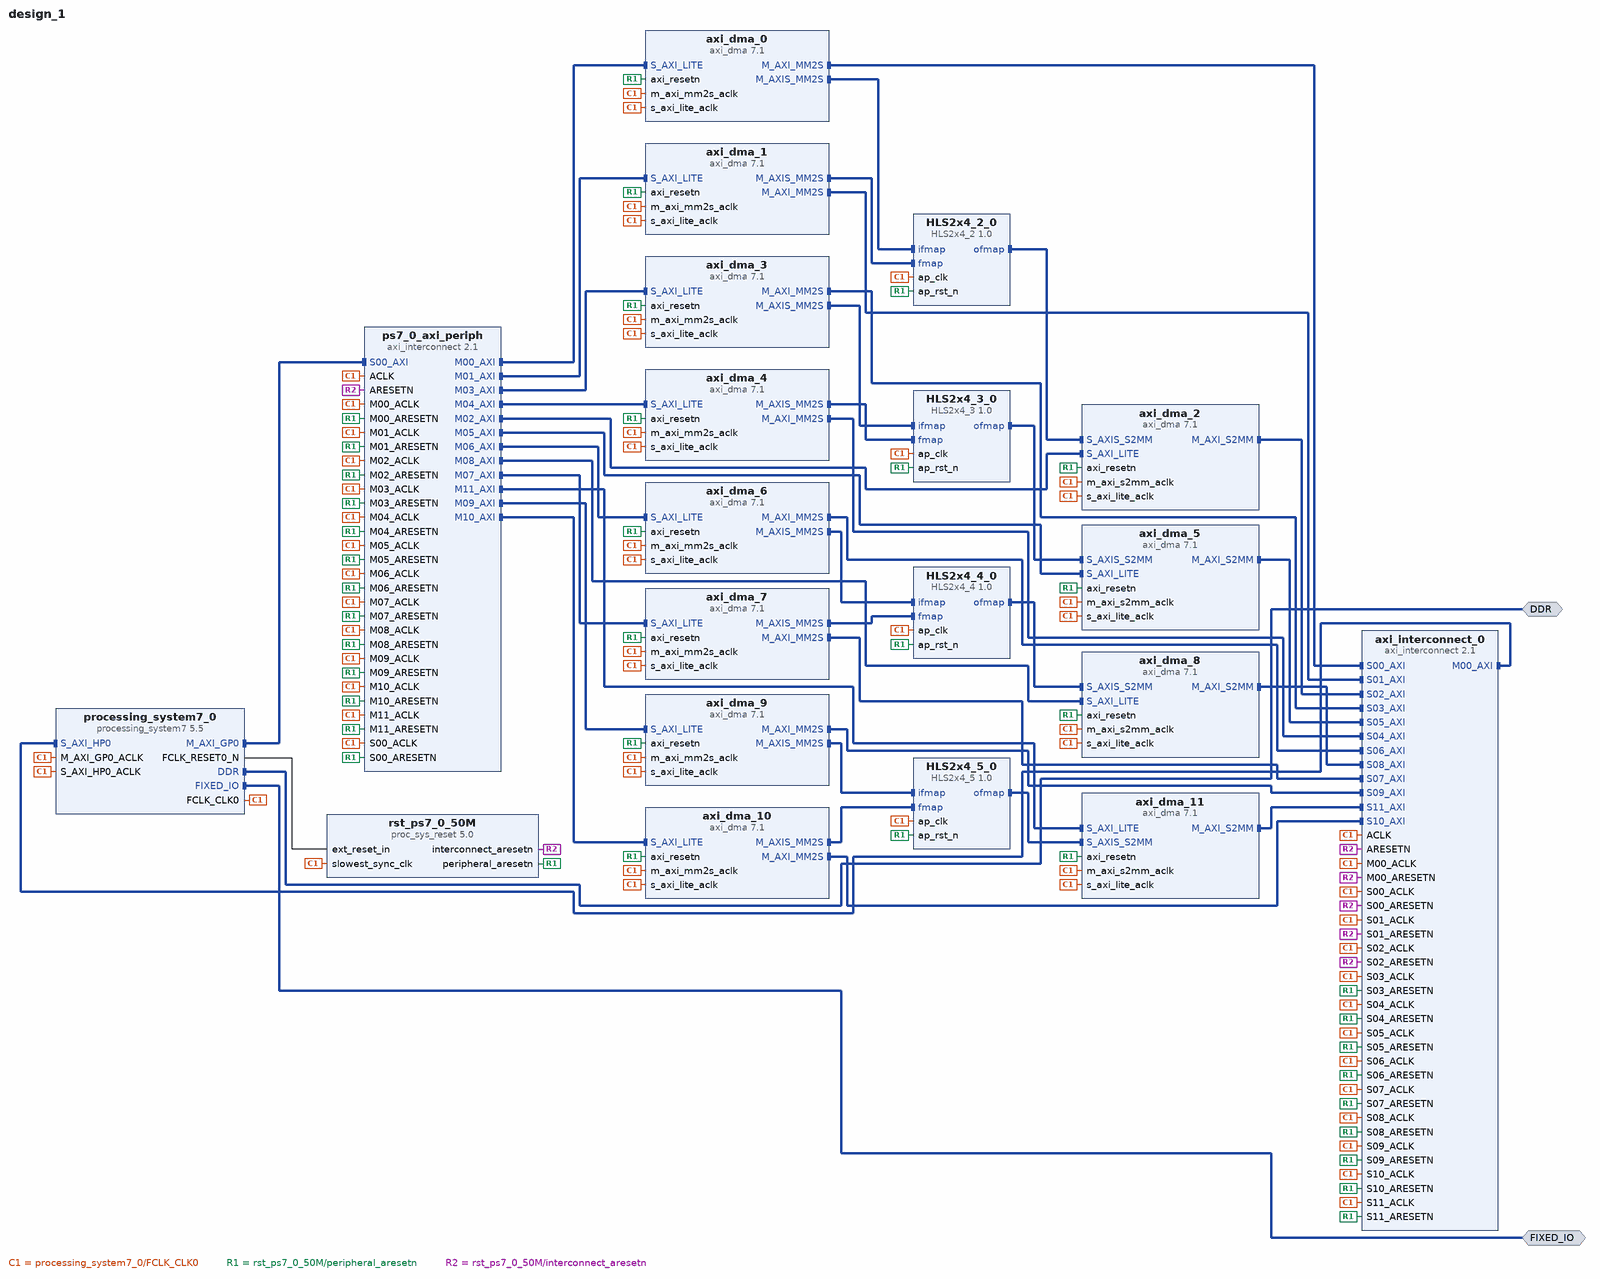
[diagram p0: block diagram of the top level]
# Vivado block design design_1, xc7z020clg400-1, Vivado 2017.4
create_bd_design design_1

create_bd_intf_port -mode Master -vlnv xilinx.com:interface:ddrx_rtl:1.0 DDR
create_bd_intf_port -mode Master -vlnv xilinx.com:display_processing_system7:fixedio_rtl:1.0 FIXED_IO

create_bd_cell -type ip -vlnv xilinx.com:user:HLS2x4_2:1.0 HLS2x4_2_0
create_bd_cell -type ip -vlnv xilinx.com:ip:processing_system7:5.5 processing_system7_0
set_property -dict [list \
  CONFIG.PCW_UIPARAM_DDR_FREQ_MHZ 533.333333 \
  CONFIG.PCW_APU_PERIPHERAL_FREQMHZ 667 \
  CONFIG.PCW_UART_PERIPHERAL_FREQMHZ 100 \
  CONFIG.PCW_USE_S_AXI_HP0 1 \
  CONFIG.PCW_PRESET_BANK1_VOLTAGE {LVCMOS 1.8V} \
  CONFIG.PCW_UIPARAM_DDR_MEMORY_TYPE {DDR 3 (Low Voltage)} \
  CONFIG.PCW_UIPARAM_DDR_PARTNO {MT41K256M16 RE-125} \
  CONFIG.PCW_QSPI_PERIPHERAL_ENABLE 0 \
  CONFIG.PCW_ENET0_PERIPHERAL_ENABLE 0 \
  CONFIG.PCW_SD0_PERIPHERAL_ENABLE 0 \
  CONFIG.PCW_UART1_PERIPHERAL_ENABLE 1 \
  CONFIG.PCW_UART1_UART1_IO {MIO 48 .. 49} \
  CONFIG.PCW_USB0_PERIPHERAL_ENABLE 0 \
  CONFIG.PCW_GPIO_MIO_GPIO_ENABLE 0 \
] [get_bd_cells processing_system7_0]
# 145 more settings of processing_system7_0 are not shown: defaults, MIO pin electricals, DDR timing, and values the tool derives
create_bd_cell -type ip -vlnv xilinx.com:ip:axi_dma:7.1 axi_dma_0
set_property -dict [list \
  CONFIG.c_include_sg 0 \
  CONFIG.c_sg_length_width 23 \
  CONFIG.c_mm2s_burst_size 64 \
  CONFIG.c_include_s2mm 0 \
] [get_bd_cells axi_dma_0]
create_bd_cell -type ip -vlnv xilinx.com:ip:axi_interconnect:2.1 ps7_0_axi_periph
set_property -dict {CONFIG.NUM_MI 12} [get_bd_cells ps7_0_axi_periph]
create_bd_cell -type ip -vlnv xilinx.com:ip:proc_sys_reset:5.0 rst_ps7_0_50M
create_bd_cell -type ip -vlnv xilinx.com:ip:axi_dma:7.1 axi_dma_1
set_property -dict [list \
  CONFIG.c_include_sg 0 \
  CONFIG.c_sg_length_width 23 \
  CONFIG.c_mm2s_burst_size 64 \
  CONFIG.c_include_s2mm 0 \
] [get_bd_cells axi_dma_1]
create_bd_cell -type ip -vlnv xilinx.com:ip:axi_dma:7.1 axi_dma_2
set_property -dict [list \
  CONFIG.c_include_sg 0 \
  CONFIG.c_sg_length_width 23 \
  CONFIG.c_include_mm2s 0 \
  CONFIG.c_s2mm_burst_size 64 \
] [get_bd_cells axi_dma_2]
create_bd_cell -type ip -vlnv xilinx.com:ip:axi_interconnect:2.1 axi_interconnect_0
set_property -dict {CONFIG.NUM_SI 12 CONFIG.NUM_MI 1} [get_bd_cells axi_interconnect_0]
create_bd_cell -type ip -vlnv xilinx.com:ip:axi_dma:7.1 axi_dma_3
set_property -dict [list \
  CONFIG.c_include_sg 0 \
  CONFIG.c_sg_length_width 23 \
  CONFIG.c_mm2s_burst_size 64 \
  CONFIG.c_include_s2mm 0 \
] [get_bd_cells axi_dma_3]
create_bd_cell -type ip -vlnv xilinx.com:ip:axi_dma:7.1 axi_dma_4
set_property -dict [list \
  CONFIG.c_include_sg 0 \
  CONFIG.c_sg_length_width 23 \
  CONFIG.c_mm2s_burst_size 64 \
  CONFIG.c_include_s2mm 0 \
] [get_bd_cells axi_dma_4]
create_bd_cell -type ip -vlnv xilinx.com:ip:axi_dma:7.1 axi_dma_5
set_property -dict [list \
  CONFIG.c_include_sg 0 \
  CONFIG.c_sg_length_width 23 \
  CONFIG.c_include_mm2s 0 \
  CONFIG.c_s2mm_burst_size 64 \
] [get_bd_cells axi_dma_5]
create_bd_cell -type ip -vlnv xilinx.com:user:HLS2x4_3:1.0 HLS2x4_3_0
create_bd_cell -type ip -vlnv xilinx.com:ip:axi_dma:7.1 axi_dma_6
set_property -dict [list \
  CONFIG.c_include_sg 0 \
  CONFIG.c_sg_length_width 23 \
  CONFIG.c_mm2s_burst_size 64 \
  CONFIG.c_include_s2mm 0 \
] [get_bd_cells axi_dma_6]
create_bd_cell -type ip -vlnv xilinx.com:ip:axi_dma:7.1 axi_dma_7
set_property -dict [list \
  CONFIG.c_include_sg 0 \
  CONFIG.c_sg_length_width 23 \
  CONFIG.c_mm2s_burst_size 64 \
  CONFIG.c_include_s2mm 0 \
] [get_bd_cells axi_dma_7]
create_bd_cell -type ip -vlnv xilinx.com:ip:axi_dma:7.1 axi_dma_8
set_property -dict [list \
  CONFIG.c_include_sg 0 \
  CONFIG.c_sg_length_width 23 \
  CONFIG.c_include_mm2s 0 \
  CONFIG.c_s2mm_burst_size 64 \
] [get_bd_cells axi_dma_8]
create_bd_cell -type ip -vlnv xilinx.com:user:HLS2x4_4:1.0 HLS2x4_4_0
create_bd_cell -type ip -vlnv xilinx.com:user:HLS2x4_5:1.0 HLS2x4_5_0
create_bd_cell -type ip -vlnv xilinx.com:ip:axi_dma:7.1 axi_dma_9
set_property -dict [list \
  CONFIG.c_include_sg 0 \
  CONFIG.c_sg_length_width 23 \
  CONFIG.c_mm2s_burst_size 64 \
  CONFIG.c_include_s2mm 0 \
] [get_bd_cells axi_dma_9]
create_bd_cell -type ip -vlnv xilinx.com:ip:axi_dma:7.1 axi_dma_10
set_property -dict [list \
  CONFIG.c_include_sg 0 \
  CONFIG.c_sg_length_width 23 \
  CONFIG.c_mm2s_burst_size 64 \
  CONFIG.c_include_s2mm 0 \
] [get_bd_cells axi_dma_10]
create_bd_cell -type ip -vlnv xilinx.com:ip:axi_dma:7.1 axi_dma_11
set_property -dict [list \
  CONFIG.c_include_sg 0 \
  CONFIG.c_sg_length_width 23 \
  CONFIG.c_include_mm2s 0 \
  CONFIG.c_s2mm_burst_size 64 \
] [get_bd_cells axi_dma_11]

# ---- connections ----

connect_bd_intf_net [get_bd_intf_pins processing_system7_0/M_AXI_GP0] [get_bd_intf_pins ps7_0_axi_periph/S00_AXI]
connect_bd_intf_net [get_bd_intf_pins ps7_0_axi_periph/M00_AXI] [get_bd_intf_pins axi_dma_0/S_AXI_LITE]
connect_bd_intf_net [get_bd_intf_pins ps7_0_axi_periph/M01_AXI] [get_bd_intf_pins axi_dma_1/S_AXI_LITE]
connect_bd_intf_net [get_bd_intf_pins HLS2x4_2_0/ofmap] [get_bd_intf_pins axi_dma_2/S_AXIS_S2MM]
connect_bd_intf_net [get_bd_intf_pins ps7_0_axi_periph/M02_AXI] [get_bd_intf_pins axi_dma_2/S_AXI_LITE]
connect_bd_intf_net [get_bd_intf_pins axi_dma_0/M_AXI_MM2S] [get_bd_intf_pins axi_interconnect_0/S00_AXI]
connect_bd_intf_net [get_bd_intf_pins axi_dma_1/M_AXI_MM2S] [get_bd_intf_pins axi_interconnect_0/S01_AXI]
connect_bd_intf_net [get_bd_intf_pins axi_dma_2/M_AXI_S2MM] [get_bd_intf_pins axi_interconnect_0/S02_AXI]
connect_bd_intf_net [get_bd_intf_pins axi_interconnect_0/M00_AXI] [get_bd_intf_pins processing_system7_0/S_AXI_HP0]
connect_bd_intf_net [get_bd_intf_pins HLS2x4_3_0/ofmap] [get_bd_intf_pins axi_dma_5/S_AXIS_S2MM]
connect_bd_intf_net [get_bd_intf_pins axi_dma_3/S_AXI_LITE] [get_bd_intf_pins ps7_0_axi_periph/M03_AXI]
connect_bd_intf_net [get_bd_intf_pins axi_dma_4/S_AXI_LITE] [get_bd_intf_pins ps7_0_axi_periph/M04_AXI]
connect_bd_intf_net [get_bd_intf_pins axi_dma_3/M_AXI_MM2S] [get_bd_intf_pins axi_interconnect_0/S03_AXI]
connect_bd_intf_net [get_bd_intf_pins axi_dma_4/M_AXI_MM2S] [get_bd_intf_pins axi_interconnect_0/S04_AXI]
connect_bd_intf_net [get_bd_intf_pins ps7_0_axi_periph/M05_AXI] [get_bd_intf_pins axi_dma_5/S_AXI_LITE]
connect_bd_intf_net [get_bd_intf_pins axi_dma_5/M_AXI_S2MM] [get_bd_intf_pins axi_interconnect_0/S05_AXI]
connect_bd_intf_net [get_bd_intf_pins HLS2x4_4_0/ofmap] [get_bd_intf_pins axi_dma_8/S_AXIS_S2MM]
connect_bd_intf_net [get_bd_intf_pins ps7_0_axi_periph/M06_AXI] [get_bd_intf_pins axi_dma_6/S_AXI_LITE]
connect_bd_intf_net [get_bd_intf_pins axi_dma_6/M_AXI_MM2S] [get_bd_intf_pins axi_interconnect_0/S06_AXI]
connect_bd_intf_net [get_bd_intf_pins ps7_0_axi_periph/M07_AXI] [get_bd_intf_pins axi_dma_7/S_AXI_LITE]
connect_bd_intf_net [get_bd_intf_pins axi_dma_7/M_AXI_MM2S] [get_bd_intf_pins axi_interconnect_0/S07_AXI]
connect_bd_intf_net [get_bd_intf_pins ps7_0_axi_periph/M08_AXI] [get_bd_intf_pins axi_dma_8/S_AXI_LITE]
connect_bd_intf_net [get_bd_intf_pins axi_dma_8/M_AXI_S2MM] [get_bd_intf_pins axi_interconnect_0/S08_AXI]
connect_bd_intf_net [get_bd_intf_pins HLS2x4_5_0/ofmap] [get_bd_intf_pins axi_dma_11/S_AXIS_S2MM]
connect_bd_intf_net [get_bd_intf_pins ps7_0_axi_periph/M09_AXI] [get_bd_intf_pins axi_dma_9/S_AXI_LITE]
connect_bd_intf_net [get_bd_intf_pins axi_dma_9/M_AXI_MM2S] [get_bd_intf_pins axi_interconnect_0/S09_AXI]
connect_bd_intf_net [get_bd_intf_pins ps7_0_axi_periph/M10_AXI] [get_bd_intf_pins axi_dma_10/S_AXI_LITE]
connect_bd_intf_net [get_bd_intf_pins axi_dma_10/M_AXI_MM2S] [get_bd_intf_pins axi_interconnect_0/S10_AXI]
connect_bd_intf_net [get_bd_intf_pins ps7_0_axi_periph/M11_AXI] [get_bd_intf_pins axi_dma_11/S_AXI_LITE]
connect_bd_intf_net [get_bd_intf_pins axi_dma_11/M_AXI_S2MM] [get_bd_intf_pins axi_interconnect_0/S11_AXI]
connect_bd_intf_net [get_bd_intf_pins axi_dma_3/M_AXIS_MM2S] [get_bd_intf_pins HLS2x4_3_0/ifmap]
connect_bd_intf_net [get_bd_intf_pins axi_dma_4/M_AXIS_MM2S] [get_bd_intf_pins HLS2x4_3_0/fmap]
connect_bd_intf_net [get_bd_intf_pins axi_dma_6/M_AXIS_MM2S] [get_bd_intf_pins HLS2x4_4_0/ifmap]
connect_bd_intf_net [get_bd_intf_pins axi_dma_7/M_AXIS_MM2S] [get_bd_intf_pins HLS2x4_4_0/fmap]
connect_bd_intf_net [get_bd_intf_pins axi_dma_1/M_AXIS_MM2S] [get_bd_intf_pins HLS2x4_2_0/fmap]
connect_bd_intf_net [get_bd_intf_pins axi_dma_0/M_AXIS_MM2S] [get_bd_intf_pins HLS2x4_2_0/ifmap]
connect_bd_intf_net [get_bd_intf_pins axi_dma_10/M_AXIS_MM2S] [get_bd_intf_pins HLS2x4_5_0/fmap]
connect_bd_intf_net [get_bd_intf_pins axi_dma_9/M_AXIS_MM2S] [get_bd_intf_pins HLS2x4_5_0/ifmap]
connect_bd_intf_net [get_bd_intf_ports DDR] [get_bd_intf_pins processing_system7_0/DDR]
connect_bd_intf_net [get_bd_intf_ports FIXED_IO] [get_bd_intf_pins processing_system7_0/FIXED_IO]
connect_bd_net [get_bd_pins processing_system7_0/FCLK_CLK0] \
  [get_bd_pins processing_system7_0/M_AXI_GP0_ACLK] [get_bd_pins rst_ps7_0_50M/slowest_sync_clk] \
  [get_bd_pins axi_dma_0/s_axi_lite_aclk] [get_bd_pins HLS2x4_2_0/ap_clk] [get_bd_pins axi_dma_0/m_axi_mm2s_aclk] \
  [get_bd_pins axi_dma_1/s_axi_lite_aclk] [get_bd_pins axi_dma_1/m_axi_mm2s_aclk] [get_bd_pins axi_dma_2/s_axi_lite_aclk] \
  [get_bd_pins axi_dma_2/m_axi_s2mm_aclk] [get_bd_pins processing_system7_0/S_AXI_HP0_ACLK] \
  [get_bd_pins axi_dma_3/m_axi_mm2s_aclk] [get_bd_pins axi_dma_3/s_axi_lite_aclk] [get_bd_pins axi_dma_4/m_axi_mm2s_aclk] \
  [get_bd_pins axi_dma_4/s_axi_lite_aclk] [get_bd_pins axi_dma_5/s_axi_lite_aclk] [get_bd_pins axi_dma_5/m_axi_s2mm_aclk] \
  [get_bd_pins HLS2x4_3_0/ap_clk] [get_bd_pins axi_dma_6/s_axi_lite_aclk] [get_bd_pins axi_dma_6/m_axi_mm2s_aclk] \
  [get_bd_pins axi_dma_7/s_axi_lite_aclk] [get_bd_pins axi_dma_7/m_axi_mm2s_aclk] [get_bd_pins axi_dma_8/s_axi_lite_aclk] \
  [get_bd_pins axi_dma_8/m_axi_s2mm_aclk] [get_bd_pins HLS2x4_4_0/ap_clk] [get_bd_pins HLS2x4_5_0/ap_clk] \
  [get_bd_pins axi_dma_9/s_axi_lite_aclk] [get_bd_pins axi_dma_9/m_axi_mm2s_aclk] [get_bd_pins axi_dma_10/s_axi_lite_aclk] \
  [get_bd_pins axi_dma_10/m_axi_mm2s_aclk] [get_bd_pins axi_dma_11/s_axi_lite_aclk] [get_bd_pins axi_dma_11/m_axi_s2mm_aclk] \
  [get_bd_pins ps7_0_axi_periph/S00_ACLK] [get_bd_pins ps7_0_axi_periph/M00_ACLK] [get_bd_pins ps7_0_axi_periph/ACLK] \
  [get_bd_pins ps7_0_axi_periph/M01_ACLK] [get_bd_pins ps7_0_axi_periph/M02_ACLK] [get_bd_pins axi_interconnect_0/ACLK] \
  [get_bd_pins axi_interconnect_0/M00_ACLK] [get_bd_pins axi_interconnect_0/S00_ACLK] \
  [get_bd_pins axi_interconnect_0/S01_ACLK] [get_bd_pins axi_interconnect_0/S02_ACLK] \
  [get_bd_pins axi_interconnect_0/S03_ACLK] [get_bd_pins ps7_0_axi_periph/M03_ACLK] [get_bd_pins axi_interconnect_0/S04_ACLK] \
  [get_bd_pins ps7_0_axi_periph/M04_ACLK] [get_bd_pins ps7_0_axi_periph/M05_ACLK] [get_bd_pins axi_interconnect_0/S05_ACLK] \
  [get_bd_pins ps7_0_axi_periph/M06_ACLK] [get_bd_pins axi_interconnect_0/S06_ACLK] [get_bd_pins ps7_0_axi_periph/M07_ACLK] \
  [get_bd_pins axi_interconnect_0/S07_ACLK] [get_bd_pins ps7_0_axi_periph/M08_ACLK] [get_bd_pins axi_interconnect_0/S08_ACLK] \
  [get_bd_pins ps7_0_axi_periph/M09_ACLK] [get_bd_pins axi_interconnect_0/S09_ACLK] [get_bd_pins ps7_0_axi_periph/M10_ACLK] \
  [get_bd_pins axi_interconnect_0/S10_ACLK] [get_bd_pins ps7_0_axi_periph/M11_ACLK] [get_bd_pins axi_interconnect_0/S11_ACLK]
connect_bd_net [get_bd_pins processing_system7_0/FCLK_RESET0_N] [get_bd_pins rst_ps7_0_50M/ext_reset_in]
connect_bd_net [get_bd_pins rst_ps7_0_50M/peripheral_aresetn] \
  [get_bd_pins axi_dma_0/axi_resetn] [get_bd_pins HLS2x4_2_0/ap_rst_n] [get_bd_pins axi_dma_1/axi_resetn] \
  [get_bd_pins axi_dma_2/axi_resetn] [get_bd_pins axi_dma_3/axi_resetn] [get_bd_pins axi_dma_4/axi_resetn] \
  [get_bd_pins axi_dma_5/axi_resetn] [get_bd_pins HLS2x4_3_0/ap_rst_n] [get_bd_pins axi_dma_6/axi_resetn] \
  [get_bd_pins axi_dma_7/axi_resetn] [get_bd_pins axi_dma_8/axi_resetn] [get_bd_pins HLS2x4_4_0/ap_rst_n] \
  [get_bd_pins HLS2x4_5_0/ap_rst_n] [get_bd_pins axi_dma_9/axi_resetn] [get_bd_pins axi_dma_10/axi_resetn] \
  [get_bd_pins axi_dma_11/axi_resetn] [get_bd_pins ps7_0_axi_periph/S00_ARESETN] [get_bd_pins ps7_0_axi_periph/M00_ARESETN] \
  [get_bd_pins ps7_0_axi_periph/M01_ARESETN] [get_bd_pins ps7_0_axi_periph/M02_ARESETN] \
  [get_bd_pins axi_interconnect_0/S03_ARESETN] [get_bd_pins ps7_0_axi_periph/M03_ARESETN] \
  [get_bd_pins axi_interconnect_0/S04_ARESETN] [get_bd_pins ps7_0_axi_periph/M04_ARESETN] \
  [get_bd_pins ps7_0_axi_periph/M05_ARESETN] [get_bd_pins axi_interconnect_0/S05_ARESETN] \
  [get_bd_pins ps7_0_axi_periph/M06_ARESETN] [get_bd_pins axi_interconnect_0/S06_ARESETN] \
  [get_bd_pins ps7_0_axi_periph/M07_ARESETN] [get_bd_pins axi_interconnect_0/S07_ARESETN] \
  [get_bd_pins ps7_0_axi_periph/M08_ARESETN] [get_bd_pins axi_interconnect_0/S08_ARESETN] \
  [get_bd_pins ps7_0_axi_periph/M09_ARESETN] [get_bd_pins axi_interconnect_0/S09_ARESETN] \
  [get_bd_pins ps7_0_axi_periph/M10_ARESETN] [get_bd_pins axi_interconnect_0/S10_ARESETN] \
  [get_bd_pins ps7_0_axi_periph/M11_ARESETN] [get_bd_pins axi_interconnect_0/S11_ARESETN]
connect_bd_net [get_bd_pins rst_ps7_0_50M/interconnect_aresetn] \
  [get_bd_pins ps7_0_axi_periph/ARESETN] [get_bd_pins axi_interconnect_0/ARESETN] \
  [get_bd_pins axi_interconnect_0/S00_ARESETN] [get_bd_pins axi_interconnect_0/M00_ARESETN] \
  [get_bd_pins axi_interconnect_0/S02_ARESETN] [get_bd_pins axi_interconnect_0/S01_ARESETN]

# ---- address map ----
assign_bd_address -offset 0x00000000 -range 1G -target_address_space [get_bd_addr_spaces axi_dma_0/Data_MM2S] [get_bd_addr_segs processing_system7_0/S_AXI_HP0/HP0_DDR_LOWOCM]
assign_bd_address -offset 0x00000000 -range 1G -target_address_space [get_bd_addr_spaces axi_dma_1/Data_MM2S] [get_bd_addr_segs processing_system7_0/S_AXI_HP0/HP0_DDR_LOWOCM]
assign_bd_address -offset 0x00000000 -range 1G -target_address_space [get_bd_addr_spaces axi_dma_2/Data_S2MM] [get_bd_addr_segs processing_system7_0/S_AXI_HP0/HP0_DDR_LOWOCM]
assign_bd_address -offset 0x00000000 -range 1G -target_address_space [get_bd_addr_spaces axi_dma_3/Data_MM2S] [get_bd_addr_segs processing_system7_0/S_AXI_HP0/HP0_DDR_LOWOCM]
assign_bd_address -offset 0x00000000 -range 1G -target_address_space [get_bd_addr_spaces axi_dma_4/Data_MM2S] [get_bd_addr_segs processing_system7_0/S_AXI_HP0/HP0_DDR_LOWOCM]
assign_bd_address -offset 0x00000000 -range 1G -target_address_space [get_bd_addr_spaces axi_dma_5/Data_S2MM] [get_bd_addr_segs processing_system7_0/S_AXI_HP0/HP0_DDR_LOWOCM]
assign_bd_address -offset 0x00000000 -range 1G -target_address_space [get_bd_addr_spaces axi_dma_6/Data_MM2S] [get_bd_addr_segs processing_system7_0/S_AXI_HP0/HP0_DDR_LOWOCM]
assign_bd_address -offset 0x00000000 -range 1G -target_address_space [get_bd_addr_spaces axi_dma_7/Data_MM2S] [get_bd_addr_segs processing_system7_0/S_AXI_HP0/HP0_DDR_LOWOCM]
assign_bd_address -offset 0x00000000 -range 1G -target_address_space [get_bd_addr_spaces axi_dma_8/Data_S2MM] [get_bd_addr_segs processing_system7_0/S_AXI_HP0/HP0_DDR_LOWOCM]
assign_bd_address -offset 0x00000000 -range 1G -target_address_space [get_bd_addr_spaces axi_dma_9/Data_MM2S] [get_bd_addr_segs processing_system7_0/S_AXI_HP0/HP0_DDR_LOWOCM]
assign_bd_address -offset 0x00000000 -range 1G -target_address_space [get_bd_addr_spaces axi_dma_10/Data_MM2S] [get_bd_addr_segs processing_system7_0/S_AXI_HP0/HP0_DDR_LOWOCM]
assign_bd_address -offset 0x00000000 -range 1G -target_address_space [get_bd_addr_spaces axi_dma_11/Data_S2MM] [get_bd_addr_segs processing_system7_0/S_AXI_HP0/HP0_DDR_LOWOCM]
assign_bd_address -offset 0x40400000 -range 64K -target_address_space [get_bd_addr_spaces processing_system7_0/Data] [get_bd_addr_segs axi_dma_0/S_AXI_LITE/Reg]
assign_bd_address -offset 0x40410000 -range 64K -target_address_space [get_bd_addr_spaces processing_system7_0/Data] [get_bd_addr_segs axi_dma_1/S_AXI_LITE/Reg]
assign_bd_address -offset 0x40420000 -range 64K -target_address_space [get_bd_addr_spaces processing_system7_0/Data] [get_bd_addr_segs axi_dma_2/S_AXI_LITE/Reg]
assign_bd_address -offset 0x40430000 -range 64K -target_address_space [get_bd_addr_spaces processing_system7_0/Data] [get_bd_addr_segs axi_dma_3/S_AXI_LITE/Reg]
assign_bd_address -offset 0x40440000 -range 64K -target_address_space [get_bd_addr_spaces processing_system7_0/Data] [get_bd_addr_segs axi_dma_4/S_AXI_LITE/Reg]
assign_bd_address -offset 0x40450000 -range 64K -target_address_space [get_bd_addr_spaces processing_system7_0/Data] [get_bd_addr_segs axi_dma_5/S_AXI_LITE/Reg]
assign_bd_address -offset 0x40460000 -range 64K -target_address_space [get_bd_addr_spaces processing_system7_0/Data] [get_bd_addr_segs axi_dma_6/S_AXI_LITE/Reg]
assign_bd_address -offset 0x40470000 -range 64K -target_address_space [get_bd_addr_spaces processing_system7_0/Data] [get_bd_addr_segs axi_dma_7/S_AXI_LITE/Reg]
assign_bd_address -offset 0x40480000 -range 64K -target_address_space [get_bd_addr_spaces processing_system7_0/Data] [get_bd_addr_segs axi_dma_8/S_AXI_LITE/Reg]
assign_bd_address -offset 0x40490000 -range 64K -target_address_space [get_bd_addr_spaces processing_system7_0/Data] [get_bd_addr_segs axi_dma_9/S_AXI_LITE/Reg]
assign_bd_address -offset 0x404A0000 -range 64K -target_address_space [get_bd_addr_spaces processing_system7_0/Data] [get_bd_addr_segs axi_dma_10/S_AXI_LITE/Reg]
assign_bd_address -offset 0x404B0000 -range 64K -target_address_space [get_bd_addr_spaces processing_system7_0/Data] [get_bd_addr_segs axi_dma_11/S_AXI_LITE/Reg]

validate_bd_design
save_bd_design
